# EAGLE design PSU_Board (EAGLE 8.3.2)
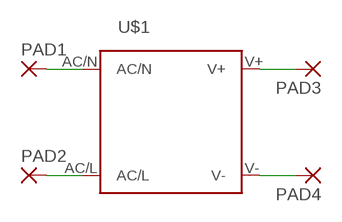
[diagram p0: schematic, sheet 1]

## Parts
PAD1  3,81/1,4  [3,81/1,4]
PAD2  3,81/1,4  [3,81/1,4]
PAD3  3,81/1,4  [3,81/1,4]
PAD4  3,81/1,4  [3,81/1,4]
U$1  IRM_15/20  [IRM_15/20]

## Nets
AC_L_IN: PAD2.1(P) U$1.AC/L
AC_N_IN: PAD1.1(P) U$1.AC/N
DC_HIGH_OUT: PAD3.1(P) U$1.V+
DC_LOW_OUT: PAD4.1(P) U$1.V-

## Library data of the parts
PAD1-PAD4 = wirepad:3,81/1,4: THROUGH-HOLE PAD
U$1 = meanwell_irm_v5:IRM_15/20: 15 or 20 watt housing & pin compatible IRM 15 Vout [V] Imax [A] Pmax [W] Eff [%] 3.3 3.5 11.55 74 5 3 15 78 12 1.25 15 82 15 1 15 82 24 0.63 15.12 83 IRM 20 Vout [V] Imax [A] Pmax [W] Eff [%] 3.3 4.5 14.85 76 5 4 20 79 12 1.8 21.6 84 15 1.4 21.6 84 24 0.9 21.6 85

## Board
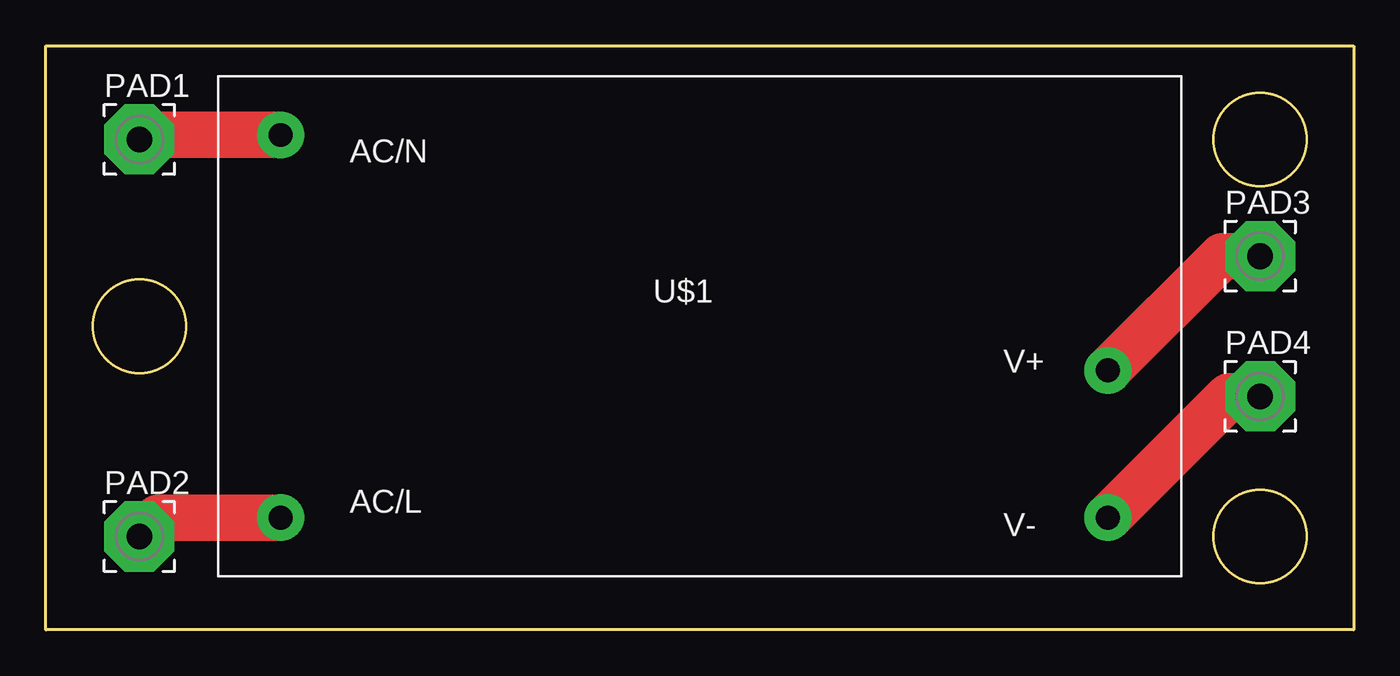
[diagram p1: board, top side]

Size 71.12 x 31.75 mm. Coordinates in mm from the lower left corner, seen from the top.
Outline: 0,0 0,31.75 71.12,31.75 71.12,0 0,0
Outline: circle at 5.08,16.51 radius 2.54
Outline: circle at 66.04,26.67 radius 2.54
Outline: circle at 66.04,5.08 radius 2.54
Copper layers (1*16): Top 0.035mm / dielectric 1.5mm / Bottom 0.035mm
Design rules "default": minimum track width 6mil, minimum drill 0.35mm, track to track 6mil, track to pad 6mil, pad to pad 6mil, via to via 6mil, smd to smd 6mil, copper to edge 40mil, drill to drill 6mil, minimum pad ring 10mil, minimum via ring 8mil, stop-mask expansion 4mil, vias tented up to drill 0mil, thermal gap 10mil

### Footprints (pad centres in the part's own frame; a part is rotated, then mirrored left to right if it is on the bottom)
3,81/1,4 = drill 1.397 pad 3.81 octagon: 1 0,0
IRM_15/20 = drill 1.3 pad 2.54: AC/L -22.8,-10.4; AC/N -22.8,10.4; V+ 22.2,-2.4; V- 22.2,-10.4

### Placement (x,y rotation side)
PAD1  5.08,26.67 0 top
PAD2  5.08,5.08 0 top
PAD3  66.04,20.32 0 top
PAD4  66.04,12.7 0 top
U$1  35.56,16.51 0 top

### Tracks (layer width: path | path; a pad name or v marks a point on that pad's centre or on a via)
AC_L_IN
  Top 2.54: U$1.AC/L 6.11,6.11 PAD2.1
AC_N_IN
  Top 2.54: PAD1.1 5.32,26.91 U$1.AC/N
DC_HIGH_OUT
  Top 2.54: U$1.V+ 63.97,20.32 PAD3.1
DC_LOW_OUT
  Top 2.54: PAD4.1 64.35,12.7 U$1.V-